# EasyEDA Pro project 主控板.epro

# Schematic Schematic1
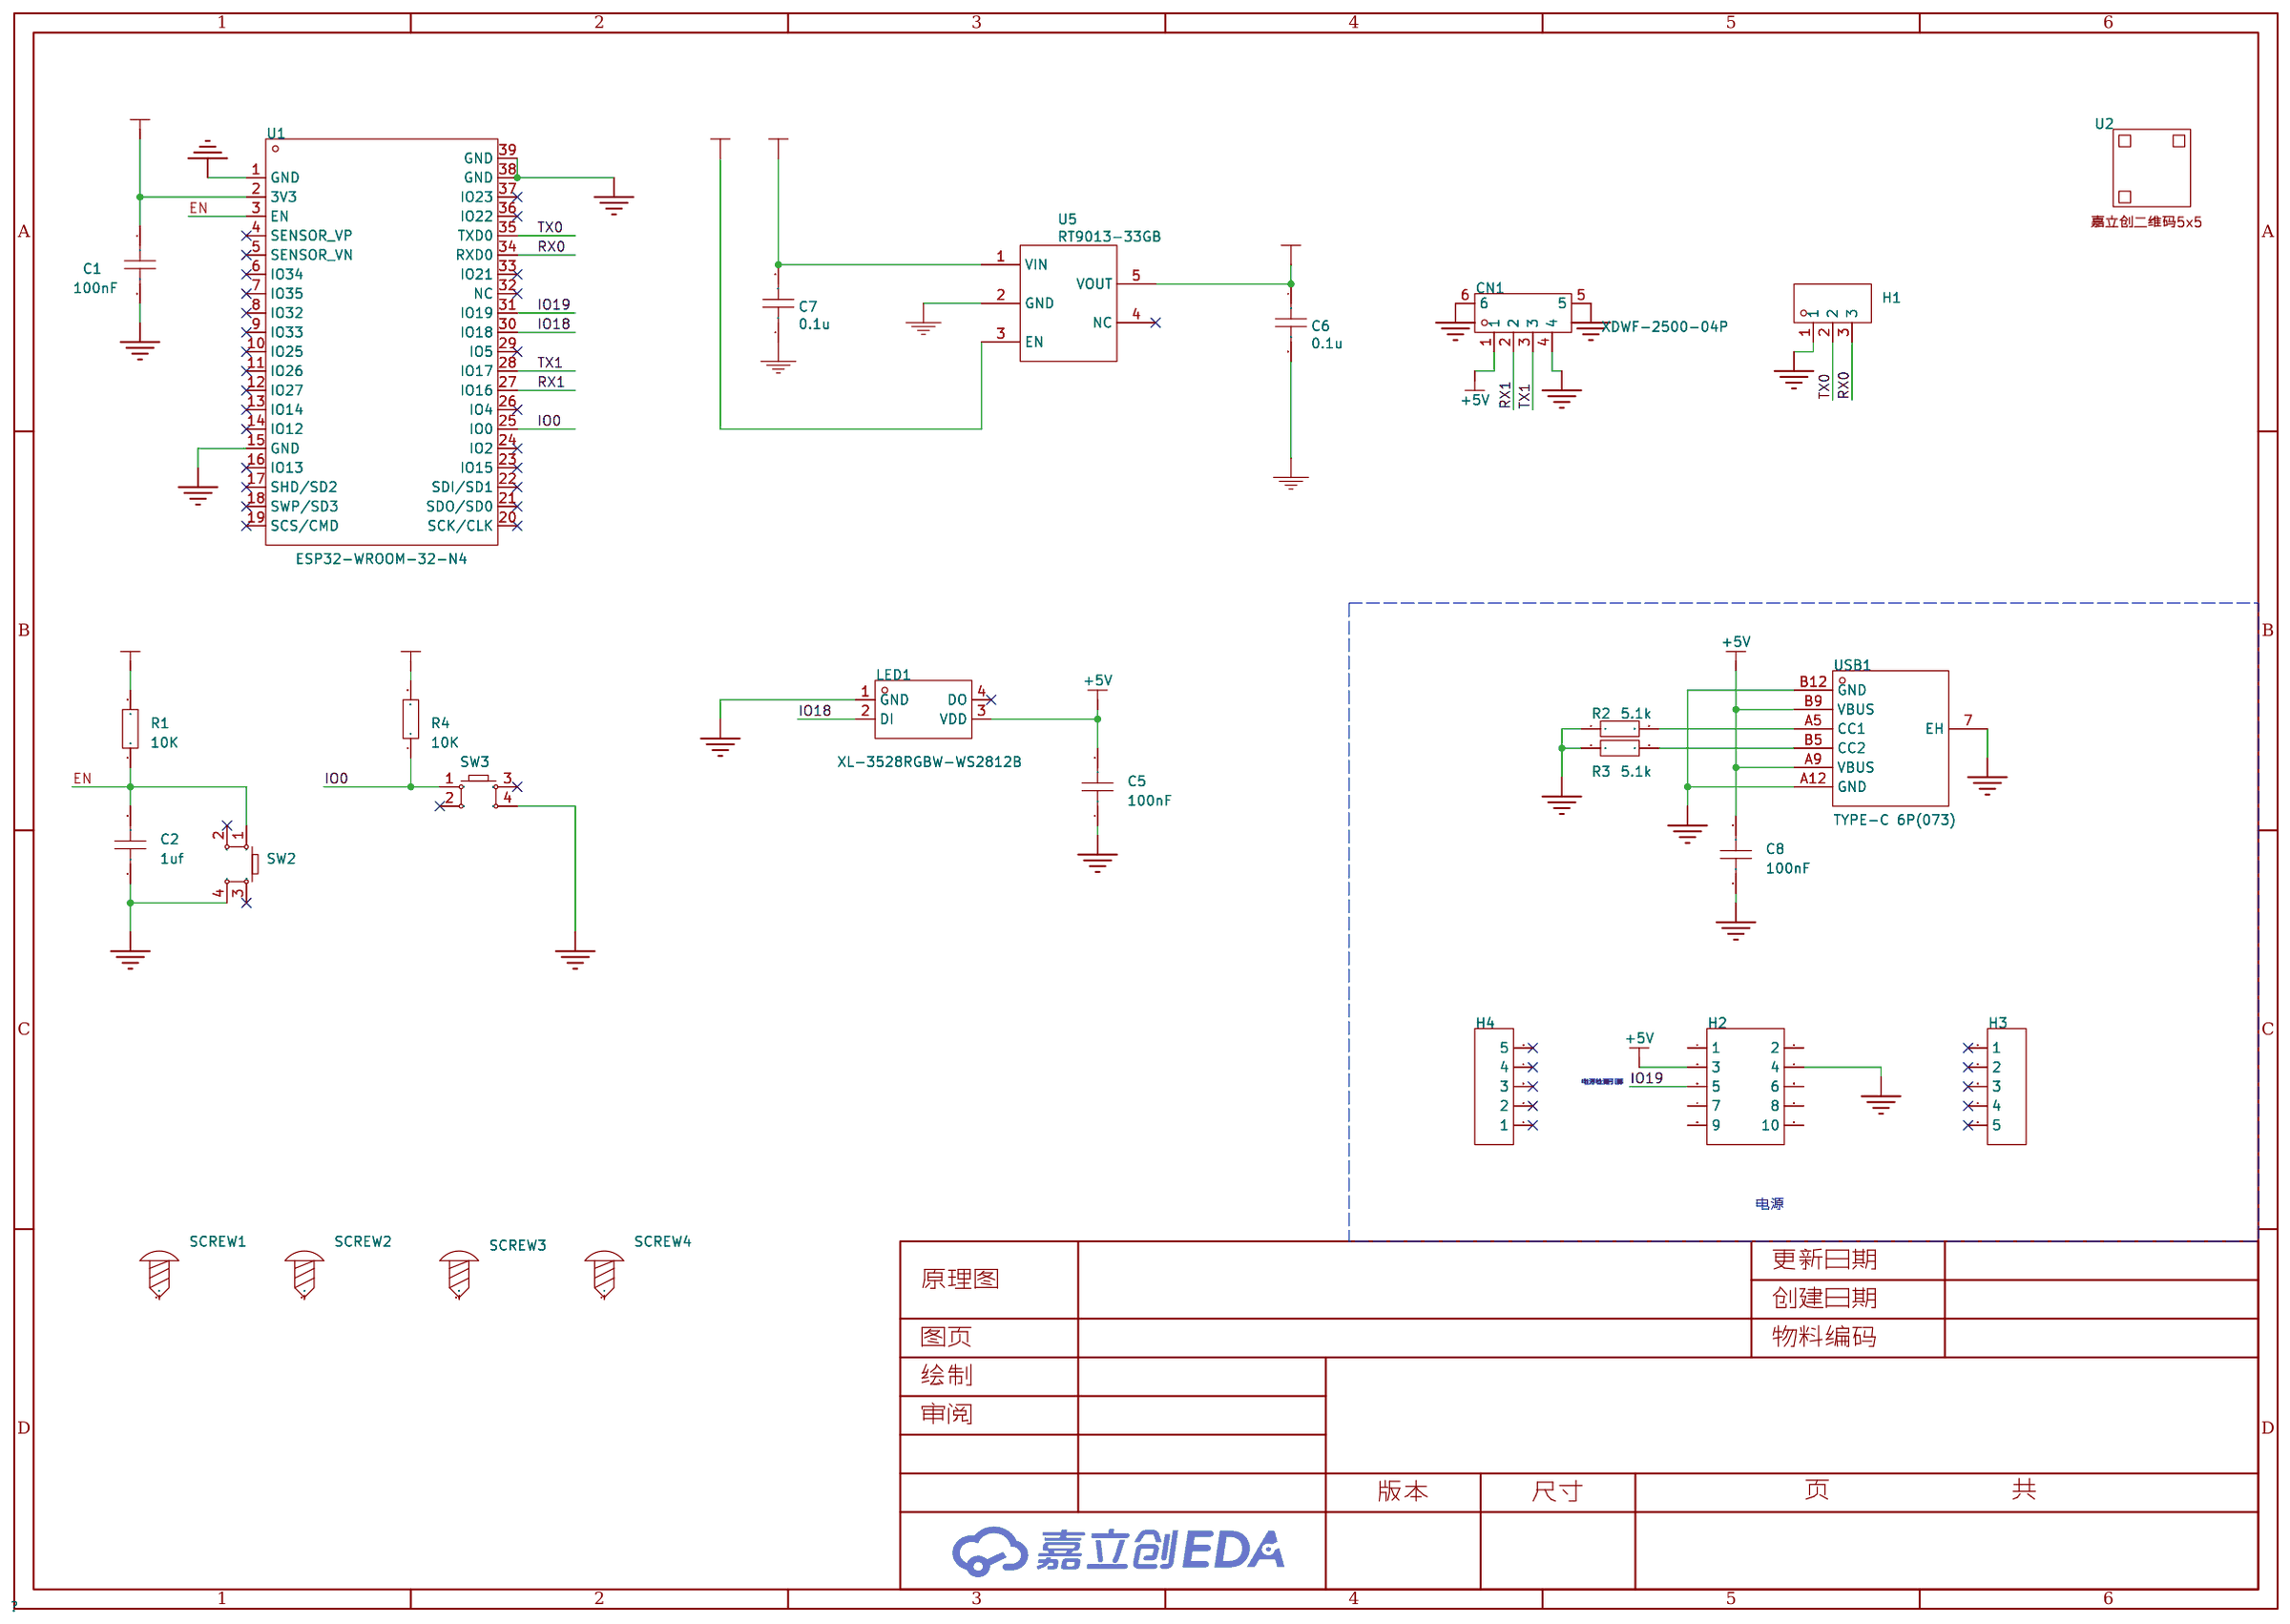
[diagram p0: schematic sheet]

## Parts
C1  100nF  [C0603]
C2  1uf  [C0603]
C5  100nF  [C0603]
C6  0.1u  [footprint_8073]
C7  0.1u  [footprint_8073]
C8  100nF  [C0603]
CN1  XDWF-2500-04P  [CONN-SMD_4P-P2.50_XDWF-2500-04P]
H1  -  [HDR-TH_3P-P2.54-V-M]
H2  -  [HDR-TH_10P-P2.54-V-F-R2-C5-S2.54]
H3  -  [HDR-TH_5P-P2.54-V-F]
H4  -  [HDR-TH_5P-P2.54-V-F]
LED1  XL-3528RGBW-WS2812B  [LED-SMD_4P-L3.5-W2.8-BR-1]
R1  10K  [R0603]
R2  5.1k  [R0603]
R3  5.1k  [R0603]
R4  10K  [R0603]
SCREW1  -  [M3螺丝]
SCREW2  -  [M3螺丝]
SCREW3  -  [M2螺丝]
SCREW4  -  [M2螺丝]
SW2  -  [SW-TH_4P-L6.0-W6.0-P4.50-LS6.5]
SW3  -  [SW-TH_4P-L6.0-W6.0-P4.50-LS6.5]
U1  ESP32-WROOM-32-N4  [WIFIM-SMD_ESP32-WROOM-32-N4]
U2  -  [JLC-QRCODE-5x5]
U5  RT9013-33GB  [footprint_ad08]
USB1  TYPE-C 6P(073)  [TYPE-C-SMD_TYPE-C-6P_5]

## Library data of the parts
C1 C2 C5 C8 = CAP_0603: Supplier Footprint: 0603
C6 C7 = 0.1u
CN1 = XDWF-2500-04P: 间距:2.54mm;安装方式:卧贴;参考系列:XH;总PIN数:4P;额定电流:4A;工作温度范围:-40℃~+85℃;; LCSC Part Name: 间距:2.54mm 卧贴 系列:XH; Supplier Part: C19723931; Manufacturer: LX(连欣科技); Supplier Footprint: SMD,P=2.5mm,卧贴; Datasheet: https://atta.szlcsc.com/upload/public/pdf/source/20231222/6CB0E40CA6FFE63C5D87C69622E580AB.pdf; Supplier: LCSC; Pitch: 2.54mm; Mounting Style: 卧贴; Reference Series: XH; Number of Pins: 4P; Current Rating (Max): 4A; Operating Temperature Range: -40℃~+85℃
H1 = HDR-M_2.54_1x3P: Supplier Part: C2937625; Supplier Footprint: 插件
H2 = HDR-F_2.54_2x5: Supplier Part: C92270; Supplier Footprint: 插件
H3 H4 = HDR-F_2.54_1x5P: Supplier Part: C50950; Supplier Footprint: 插件
LED1 = XL-3528RGBW-WS2812B: 3528 七彩幻彩雾状 ws2812B 内置驱动IC; Supplier Part: C2890364; Manufacturer: XINGLIGHT(成兴光); Supplier Footprint: SMD3528-4P; JLCPCB Part Class: 扩展库; Datasheet: https://atta.szlcsc.com/upload/public/pdf/source/20240218/041E1E0D0024617DFFF124D9C311BB4D.pdf; Supplier: LCSC
R1-R4 = Res_0603: Supplier Footprint: 0603
SCREW1 SCREW2 = M3螺丝: Supplier Footprint: 插件
SCREW3 SCREW4 = M2螺丝: Supplier Footprint: 插件
SW2 SW3 = Key_TH_6x6x6: 触点电流:50mA;额定电压(DC):12V;绝缘电阻:100MΩ;电路结构:单刀单掷;安装方式:直插;按钮形状:圆形按钮;按钮/盖帽颜色:黑色;作用力:260gf@±30gf;工作温度:-25℃~+70℃;引脚样式:PC引脚;开关长度:6mm;开关宽度:6mm;开关高度:6mm;带支架:否;; Supplier Part: C2837516; Supplier Footprint: 插件
U1 = ESP32-WROOM-32-N4: WiFi+蓝牙4.2+双核CPU,ESP32; LCSC Part Name: WiFi+蓝牙4.2+双核CPU模块; Supplier Part: C82899; Manufacturer: ESPRESSIF(乐鑫); Supplier Footprint: SMD,18x25.5mm; JLCPCB Part Class: 扩展库; Datasheet: https://atta.szlcsc.com/upload/public/pdf/source/20210719/C82899_2D52724B6FAFABC419BCF308C5944296.pdf; Supplier: LCSC
U2 = 嘉立创二维码5x5
U5 = RT9013-33GB: Supplier: LCSC; Manufacturer: RICHTEK(立锜); Supplier Part: C47773; JLCPCB Part Class: Extended Part
USB1 = TYPE-C 6P(073): 连接器类型:Type-C;标准:-;公母:母;端口数量:1;触点数量:6P;安装方式:卧贴;额定电流 - 电源:5A;工作温度范围:-25℃~+85℃;; LCSC Part Name: Type-C 母 卧贴; Supplier Part: C668623; Manufacturer: SHOU HAN(首韩); Supplier Footprint: SMD; JLCPCB Part Class: 扩展库; Datasheet: https://atta.szlcsc.com/upload/public/pdf/source/20200618/C668623_A4B260DED7AC1949BAC6AE39E9F4CD80.pdf; Supplier: LCSC; Connector Type: Type-C; Gender: 母; Number of Ports: 1; Number of Contacts: 6P; Mounting Style: 卧贴; Current Rating - Power (Max): 5A; Operating Temperature Range: -25℃~+85℃

## Nets
3.3V: C1.1 C6.1 R1.2 R4.2 U1.2(3V3) U5.5(VOUT)
+5V: C5.2 C7.2 C8.2 CN1.1 H2.3 LED1.3(VDD) U5.1(VIN) U5.3(EN) USB1.A9(VBUS) USB1.B9(VBUS)
GND: C1.2 C2.1 C5.1 C6.2 C7.1 C8.1 CN1.4 CN1.5 CN1.6 H1.1 H2.4 LED1.1(GND) R2.1 R3.1 SW2.4 SW3.4 U1.1(GND) U1.15(GND) U1.38(GND) U1.39(GND) U5.2(GND) USB1.7(EH) USB1.A12(GND) USB1.B12(GND)
EN: C2.2 R1.1 SW2.1 U1.3(EN)
IO0: R4.1 SW3.1 U1.25(IO0)
IO18: LED1.2(DI) U1.30(IO18)
IO19: H2.5 U1.31(IO19)
RX0: H1.3 U1.34(RXD0)
RX1: CN1.2 U1.27(IO16)
TX0: H1.2 U1.35(TXD0)
TX1: CN1.3 U1.28(IO17)
$1N3881: R2.2 USB1.A5(CC1)
$1N3888: R3.2 USB1.B5(CC2)

Not connected (* = marked no-connect by the designer): H2 1 2 6 7 8 9 10; H3 1* 2* 3* 4* 5*; H4 1* 2* 3* 4* 5*; LED1 4(DO)*; SCREW1 1; SCREW2 1; SCREW3 1; SCREW4 1; SW2 2* 3*; SW3 2* 3*; U1 4(SENSOR_VP)* 5(SENSOR_VN)* 6(IO34)* 7(IO35)* 8(IO32)* 9(IO33)* 10(IO25)* 11(IO26)* 12(IO27)* 13(IO14)* 14(IO12)* 16(IO13)* 17(SHD/SD2)* 18(SWP/SD3)* 19(SCS/CMD)* 20(SCK/CLK)* 21(SDO/SD0)* 22(SDI/SD1)* 23(IO15)* 24(IO2)* 26(IO4)* 29(IO5)* 32(NC)* 33(IO21)* 36(IO22)* 37(IO23)*; U5 4(NC)*

## Notes on the sheet
- 电源检测引脚
- 电源

# Board PCB1
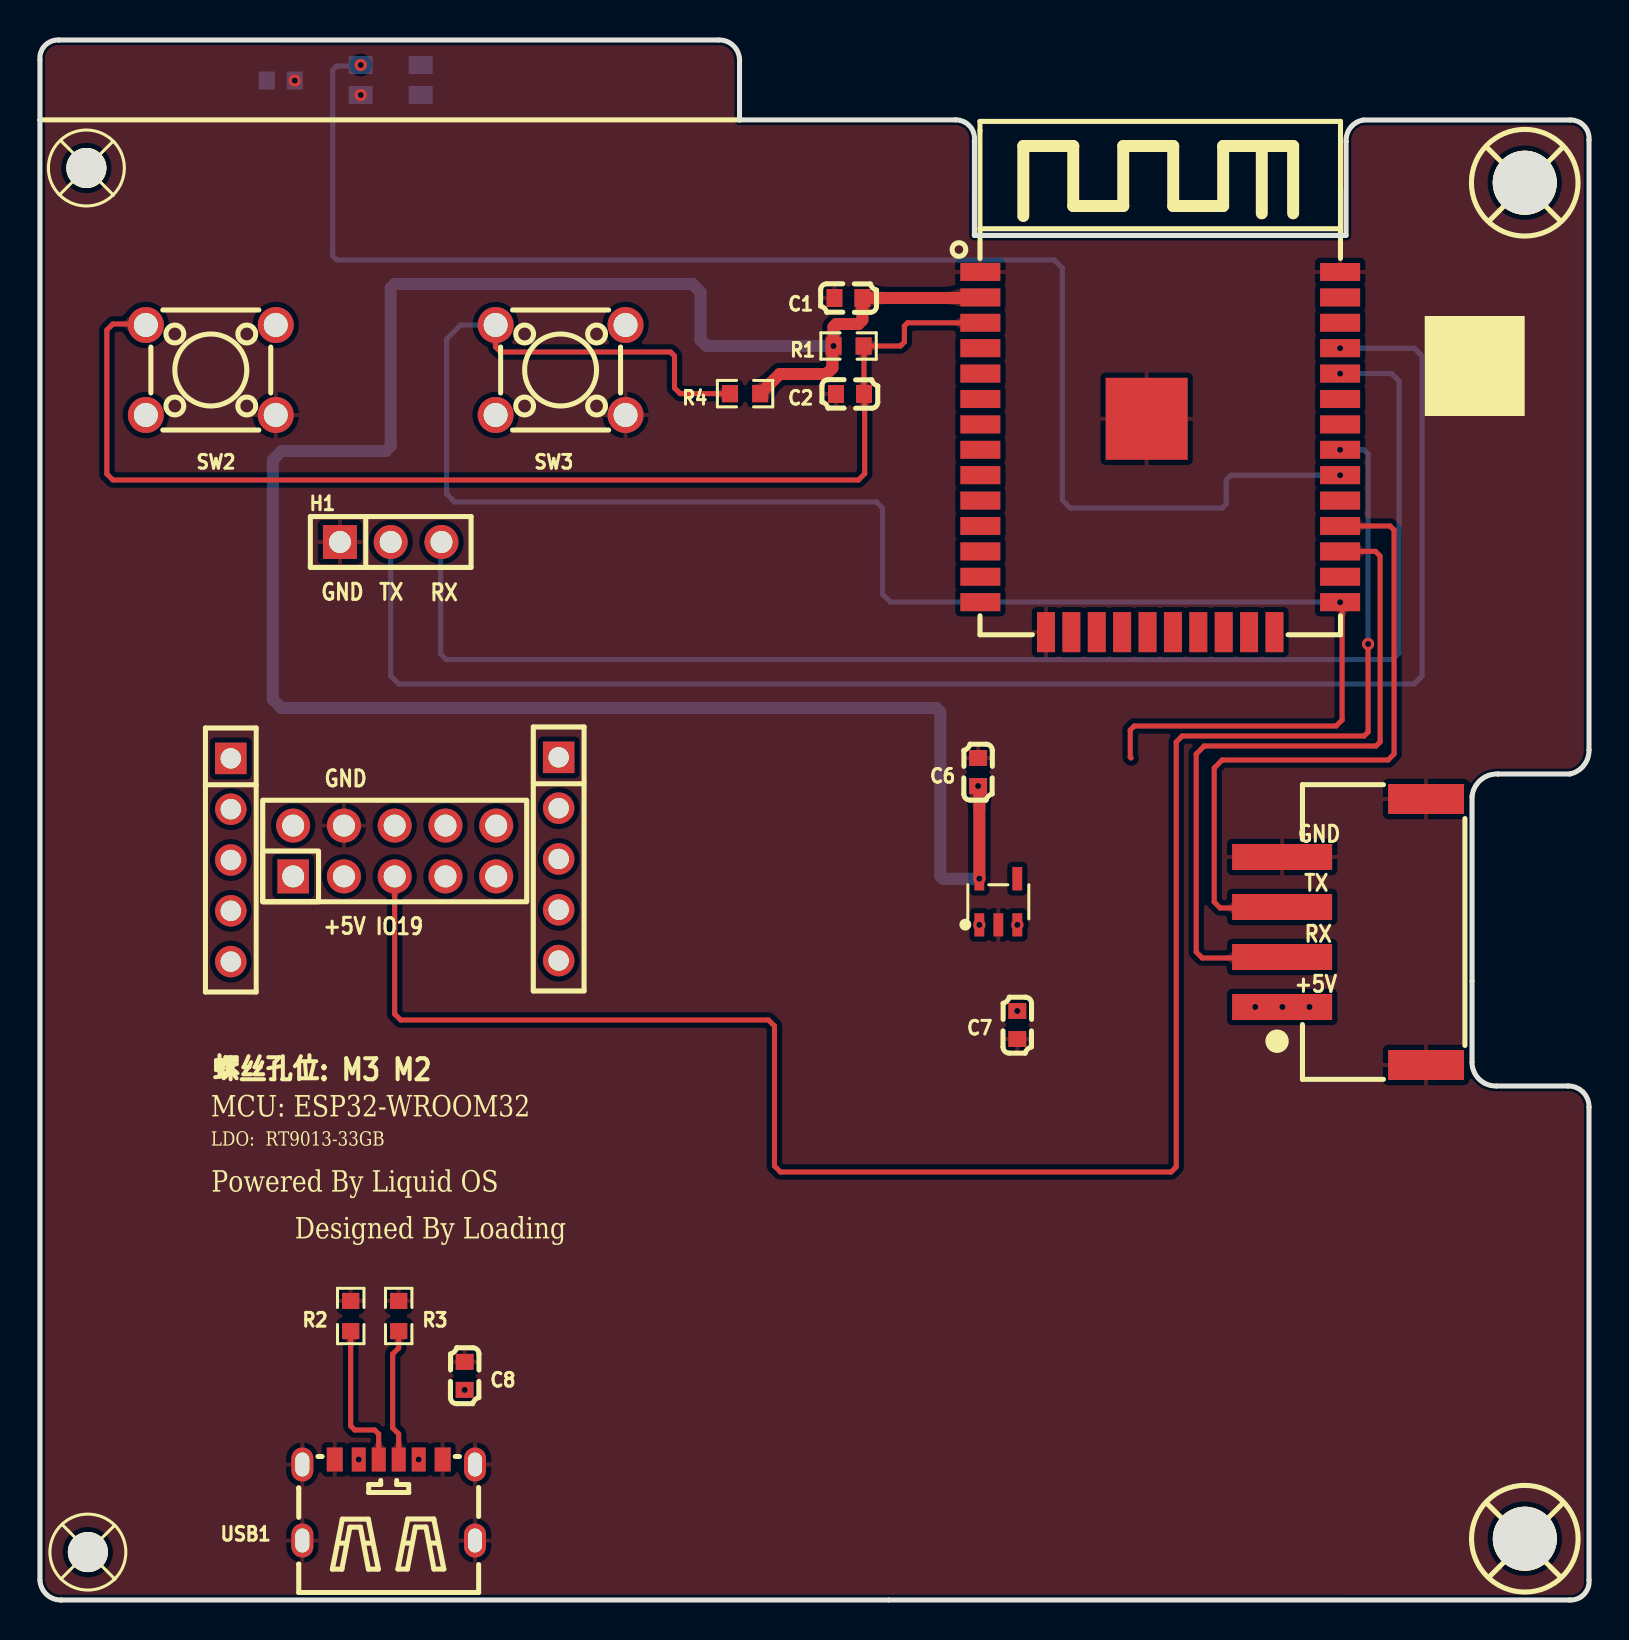
[diagram p1: board, top side]
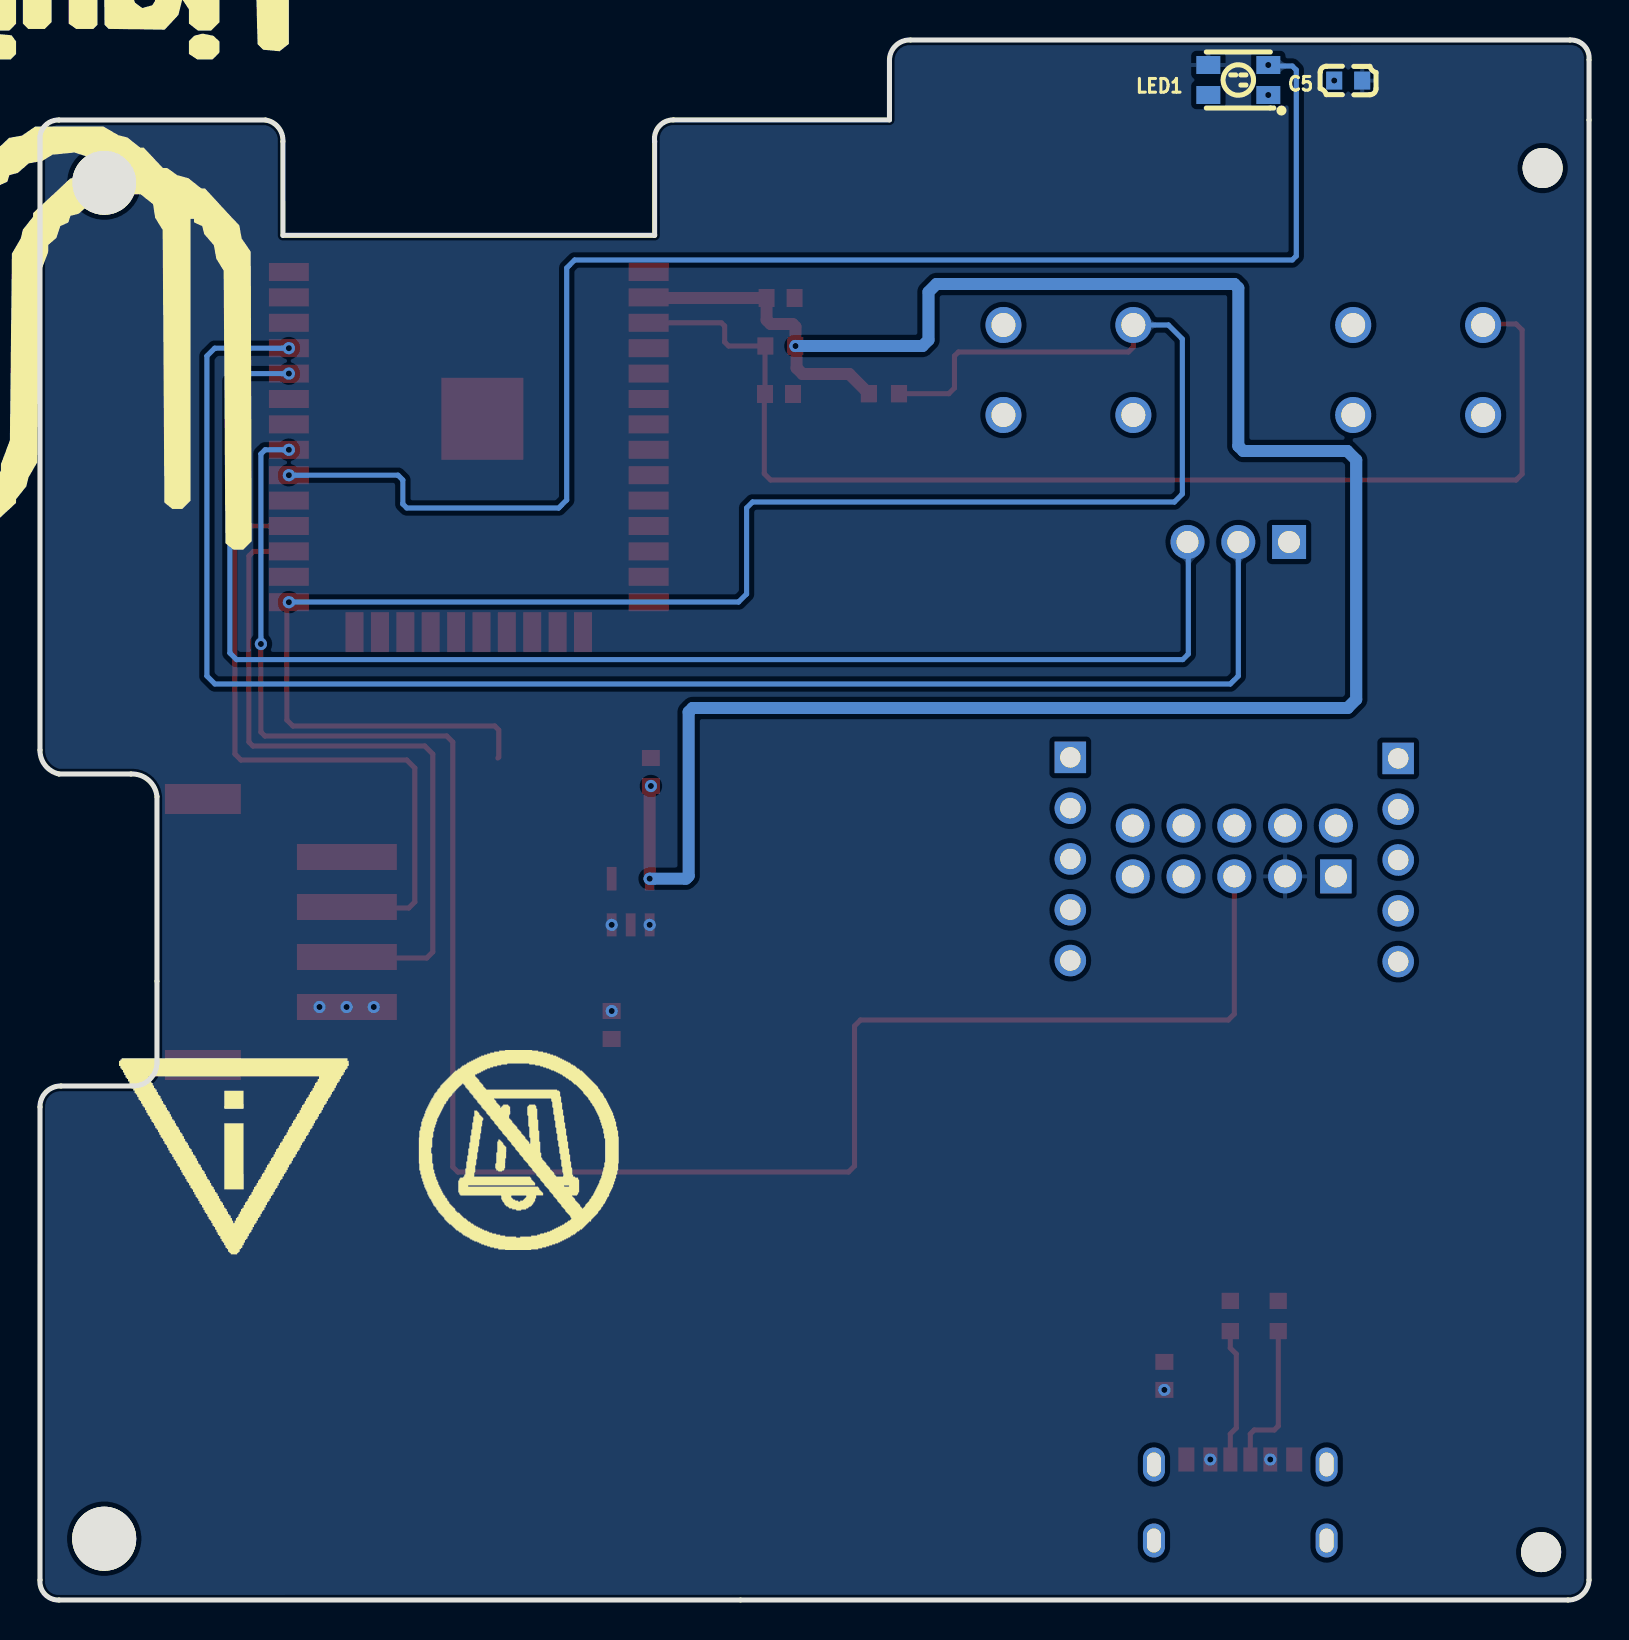
[diagram p2: board, bottom side, seen from below]

Outline 77.5 x 78 mm; copper layers: Top Layer, Bottom Layer. Coordinates in mm from the lower left corner of the outline.
Outline path: 0,77.01 arc(0.25,77.72) 0.94,78 33.94,78 arc(34.69,77.72) 35,76.99 35,74.01 45.83,74.01 arc(46.53,73.68) 46.75,72.93 46.75,68.23 65.35,68.23 65.35,72.93 arc(65.58,73.64) 66.22,74 76.56,74 arc(77.25,73.71) 77.5,73 77.5,42.5 arc(77.24,41.73) 76.55,41.3 72.94,41.3 arc(72.07,40.99) 71.65,40.17 71.65,26.89 arc(72.01,26.04) 72.87,25.7 76.45,25.7 arc(77.2,25.4) 77.5,24.65 77.5,1 arc(77.25,0.28) 76.54,0 1.06,0 arc(0.33,0.28) 0,1 0,77.01
Stack: Top Layer 0.035mm / Dielectric1 1.51mm FR4 er 4.5 / Bottom Layer 0.035mm

## Design rules (mm)
template: JLCPCB Capability(Two Layers Board)
spacing copperThickness1oz (default): track to track 0.102, other pairs 0.152 to 0.3
spacing copperThickness2oz: track to track 0.203, other pairs 0.152 to 0.3
track width copperThickness1oz (default): min 0.127, default 0.254, max 2.54
track width copperThickness2oz: min 0.203, default 0.254, max 2.54
differential pair differentialPair (default): width min 0.127, default 0.254, max 2.54; gap min 0.152, default 0.152
via viaSize (default): diameter min 0.5, default 0.61, max 10; hole min 0.3, default 0.305, max 6.3

## Placement (name value [footprint] x y rotation side)
C1  100nF  [C0603]  40.45 65.1 180 top
C2  1uf  [C0603]  40.53 60.3 0 top
C5  100nF  [C0603]  12.05 75.97 180 bottom
C6  0.1u  [footprint_8073]  46.94 41.4 90 top
C7  0.1u  [footprint_8073]  48.9 28.75 90 top
C8  100nF  [C0603]  21.25 11.21 270 top
CN1  XDWF-2500-04P  [CONN-SMD_4P-P2.50_XDWF-2500-04P]  65.75 33.4 90 top
H1  -  [HDR-TH_3P-P2.54-V-M]  17.55 52.9 0 top
H2  -  [HDR-TH_10P-P2.54-V-F-R2-C5-S2.54]  17.75 37.45 0 top
H3  -  [HDR-TH_5P-P2.54-V-F]  25.95 37.05 270 top
H4  -  [HDR-TH_5P-P2.54-V-F]  9.55 37 270 top
LED1  XL-3528RGBW-WS2812B  [LED-SMD_4P-L3.5-W2.8-BR-1]  17.55 76 180 bottom
R1  10K  [R0603]  40.46 62.7 180 top
R2  5.1k  [R0603]  15.55 14.2 270 top
R3  5.1k  [R0603]  17.95 14.2 270 top
R4  10K  [R0603]  35.28 60.32 0 top
SCREW1  -  [M3螺丝]  74.35 3 0 top
SCREW2  -  [M3螺丝]  74.35 70.8 0 top
SCREW3  -  [M2螺丝]  2.32 71.6 0 top
SCREW4  -  [M2螺丝]  2.4 2.4 0 top
SW2  -  [SW-TH_4P-L6.0-W6.0-P4.50-LS6.5]  8.55 61.5 0 top
SW3  -  [SW-TH_4P-L6.0-W6.0-P4.50-LS6.5]  26.05 61.5 0 top
U1  ESP32-WROOM-32-N4  [WIFIM-SMD_ESP32-WROOM-32-N4]  56.05 57.4 0 top
U2  -  [JLC-QRCODE-5x5]  71.78 61.7 0 top
U5  RT9013-33GB  [footprint_ad08]  47.95 34.91 0 top
USB1  TYPE-C 6P(073)  [TYPE-C-SMD_TYPE-C-6P_5]  17.45 5 0 top

## Footprints (pads in the part's own frame, mm; a bottom-side part is the same pattern mirrored in y, then rotated)
C0603
  rect 0.8x0.9 smd: 1(-0.7,0) 2(0.7,0)
CONN-SMD_4P-P2.50_XDWF-2500-04P
  rect 1.3x5 smd: 1(-3.75,3.6) 2(-1.25,3.6) 3(1.25,3.6) 4(3.75,3.6)
  rect 1.5x3.8 smd: 5(6.65,-3.6) 6(-6.65,-3.6)
footprint_8073
  rect 0.8x0.9 smd: 1(-0.7,0) 2(0.7,0)
footprint_ad08
  rect 0.49x1.157 smd: 1(-0.95,-1.153) 2(0,-1.153) 3(0.95,-1.153)
  rect 0.49x1.175 smd: 4(0.95,1.153) 5(-0.95,1.153)
HDR-TH_3P-P2.54-V-M
  rect 1.7x1.7 hole 1.1: 1(-2.54,0)
  round 1.7 hole 1.1: 2(0,0) 3(2.54,0)
HDR-TH_5P-P2.54-V-F
  rect 1.575x1.575 hole 1.02: 1(-5.08,0)
  round 1.575 hole 1.02: 2(-2.54,0) 3(0,0) 4(2.54,0) 5(5.08,0)
HDR-TH_10P-P2.54-V-F-R2-C5-S2.54
  rect 1.575x1.7 hole 1.1: 1(-5.08,-1.27)
  round 1.7 hole 1.1: 2(-5.08,1.27) 3(-2.54,-1.27) 4(-2.54,1.27) 5(0,-1.27) 6(0,1.27) 7(2.54,-1.27) 8(2.54,1.27) 9(5.08,-1.27) 10(5.08,1.27)
LED-SMD_4P-L3.5-W2.8-BR-1
  rect 1.2x0.9 smd: 1(1.5,-0.75) 2(1.5,0.75) 3(-1.5,0.75) 4(-1.5,-0.75)
M2螺丝
  round 2 hole 2: 1(0,0)
M3螺丝
  round 3.2 hole 3.2: 1(-0.064,0.064)
R0603
  rect 0.806x0.864 smd: 1(-0.753,0) 2(0.753,0)
SW-TH_4P-L6.0-W6.0-P4.50-LS6.5
  round 1.8 hole 1.2: 1(-3.25,2.25) 2(3.25,2.25) 3(-3.25,-2.25) 4(3.25,-2.25)
TYPE-C-SMD_TYPE-C-6P_5
  oval 1.1x1.7 hole 0.7x1.2: 7(-4.32,1.775) 7(-4.32,-2.025) 7(4.32,1.775) 7(4.32,-2.025)
  rect 0.7x1.2 smd: A5(-0.5,2.025) A9(1.5,2.025) B5(0.5,2.025) B9(-1.5,2.025)
  rect 0.8x1.2 smd: A12(2.7,2.025) B12(-2.7,2.025)
WIFIM-SMD_ESP32-WROOM-32-N4
  rect 2x0.9 smd: 1(-9,9.005) 2(-9,7.735) 3(-9,6.465) 4(-9,5.195) 5(-9,3.925) 6(-9,2.655) 7(-9,1.385) 8(-9,0.115) 9(-9,-1.155) 10(-9,-2.425) 11(-9,-3.695) 12(-9,-4.965) 13(-9,-6.235) 14(-9,-7.505) 25(9,-7.505) 26(9,-6.235) 27(9,-4.965) 28(9,-3.695) 29(9,-2.425) 30(9,-1.155) 31(9,0.115) 32(9,1.385) 33(9,2.655) 34(9,3.925) 35(9,5.195) 36(9,6.465) 37(9,7.735) 38(9,9.005)
  rect 0.9x2 smd: 15(-5.715,-9.005) 16(-4.445,-9.005) 17(-3.175,-9.005) 18(-1.905,-9.005) 19(-0.635,-9.005) 20(0.635,-9.005) 21(1.905,-9.005) 22(3.175,-9.005) 23(4.445,-9.005) 24(5.715,-9.005)
  rect 4.1x4.1 smd: 39(-0.68,1.665)

## Nets
As in the schematic.

Pads without a net: H2 1 2 6 7 8 9 10; H3 1 2 3 4 5; H4 1 2 3 4 5; LED1 4; SCREW1 1; SCREW2 1; SCREW3 1; SCREW4 1; SW2 2 3; SW3 2 3; U1 4 5 6 7 8 9 10 11 12 13 14 16 17 18 19 20 21 22 23 24 26 29 32 33 36 37; U5 4

## Via types
v1: diameter 0.61, hole 0.305, Top Layer to Bottom Layer, 21 vias

## Routing (per net, layer and track width the routed paths; a pad name or vN(x,y) marks a point on that pad's centre or on a via; arc(x,y) is an arc through that point)
3.3V: length 114.3
  Top Layer w0.6: v1(47,36.06) 47,40.64 v1(46.94,40.7) ; R4.2 37.01,61.3 39.35,61.3 39.65,61.6 39.65,62.65 v1(39.7,62.7) 39.7,63.65 39.85,63.8 40.95,63.8 41.15,64 C1.1 47.02,65.1 U1.2
  Bottom Layer w0.6: v1(47,36.06) 45.18,36.06 45.05,36.2 45.05,44.4 44.85,44.6 12.08,44.6 11.65,45.03 11.65,57 12.1,57.45 17.3,57.45 17.55,57.7 17.55,65.6 17.75,65.8 32.65,65.8 33.05,65.4 33.05,63 33.35,62.7 v1(39.7,62.7)
+5V:
  vias: v1(15.95,7.03) v1(18.95,7.03) v1(21.25,10.51) v1(47,33.76) v1(48.9,33.76) v1(48.9,29.45) v1(60.8,29.65) v1(62.16,29.65) v1(63.52,29.65)
GND:
  vias: v1(12.75,75.97) v1(16.05,75.25)
EN: length 60.7
  Top Layer w0.254: SW2.1 5.25,63.8 3.65,63.8 3.35,63.5 3.35,56.3 3.65,56 40.95,56 41.26,56.32 41.26,60.26 C2.2 41.23,62.68 41.21,62.7 43.05,62.7 43.25,62.9 43.25,63.7 43.41,63.86 U1.3
IO0: length 92.8
  Top Layer w0.254: R4.1 32.03,60.32 31.75,60.6 31.75,62.2 31.55,62.4 23.05,62.4 22.8,62.65 SW3.1 ; v1(65.05,49.89) 65.15,49.79 65.15,44 64.85,43.7 54.75,43.7 54.55,43.5 54.55,42.14 54.59,42.1
  Bottom Layer w0.254: v1(65.05,49.89) 65.04,49.9 42.55,49.9 42.15,50.3 42.15,54.6 41.85,54.9 20.75,54.9 20.35,55.3 20.35,63.05 21.05,63.75 SW3.1
IO18: length 74.6
  Bottom Layer w0.254: v1(16.05,76.75) 16,76.7 14.85,76.7 14.65,76.5 14.65,67.2 14.85,67 50.75,67 51.15,66.6 51.15,55 51.55,54.6 59.15,54.6 59.35,54.8 59.35,56 59.59,56.24 v1(65.05,56.24)
IO19: length 99.9
  Top Layer w0.254: v1(66.45,47.8) 66.45,43.4 66.25,43.2 57.15,43.2 56.85,42.9 56.85,21.65 56.59,21.4 37.05,21.4 36.75,21.7 36.75,28.7 36.45,29 18.05,29 17.75,29.3 H2.5
  Bottom Layer w0.254: v1(65.05,57.51) 66.24,57.51 66.45,57.3 v1(66.45,47.8)
RX0: length 70.5
  Bottom Layer w0.254: v1(65.05,61.32) 67.63,61.32 68,60.95 68,47.35 67.67,47.02 20.33,47.02 20.05,47.3 20.05,52.86 H1.3
RX1: length 35.2
  Top Layer w0.254: U1.27 66.82,52.43 67.05,52.2 67.05,42.9 66.85,42.7 58.25,42.7 57.85,42.3 57.85,32.4 58.15,32.1 62.1,32.1 CN1.2
TX0: length 78.9
  Bottom Layer w0.254: v1(65.05,62.59) 68.76,62.59 69.15,62.2 69.15,46.2 68.75,45.8 17.95,45.8 17.55,46.2 H1.2
TX1: length 33.5
  Top Layer w0.254: U1.28 67.55,53.7 67.75,53.5 67.75,42.3 67.45,42 59.15,42 58.75,41.6 58.75,34.9 59.05,34.6 62.1,34.6 CN1.3
$1N3881: length 7.6
  Top Layer w0.254: R2.2 15.55,8.7 15.75,8.5 16.75,8.5 16.95,8.3 USB1.A5
$1N3888: length 6.7
  Top Layer w0.254: USB1.B5 17.95,8.3 17.65,8.6 17.65,12.3 17.95,12.6 R3.2

## Copper pours and planes (outline as drawn; the poured copper is in the pictures)
+5V on Bottom Layer: -9.65,82.1 88.75,82.1 88.75,-5.8 -9.65,-5.8
GND on Top Layer: -8.05,95.8 81.75,95.8 81.75,-3.7 -8.05,-3.7

Small or netless copper shapes (teardrops, artwork), in the pictures only: 30 on Top Layer, 13 on Bottom Layer

## Text on the board
Top Solder Mask Layer: 极光桌面终端
Top Silkscreen Layer: +5V | GND | IO19 | TX | RX | LDO:  RT9013-33GB | 螺丝孔位: M3 M2 | MCU: ESP32-WROOM32 | Powered By Liquid OS | Designed By Loading
